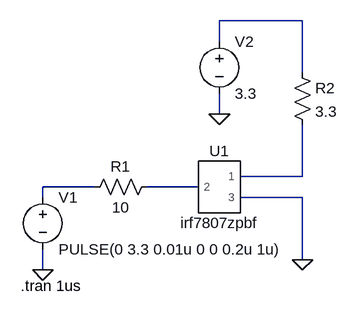
[diagram p0: schematic Frontend.asc]
Frontend.asc, the LTspice schematic file:
Version 4
SHEET 1 880 680
WIRE 304 -112 176 -112
WIRE 176 -80 176 -112
WIRE 304 -32 304 -112
WIRE 176 32 176 0
WIRE 304 128 304 48
WIRE 304 128 208 128
WIRE -16 144 -96 144
WIRE 144 144 64 144
WIRE -96 160 -96 144
WIRE 304 160 208 160
WIRE 304 256 304 160
WIRE -96 272 -96 240
FLAG 304 256 0
FLAG -96 272 0
FLAG 176 32 0
SYMBOL voltage -96 144 R0
WINDOW 123 0 0 Left 0
WINDOW 39 0 0 Left 0
SYMATTR InstName V1
SYMATTR Value PULSE(0 3.3 0.01u 0 0 0.2u 1u)
SYMBOL voltage 176 -96 R0
SYMATTR InstName V2
SYMATTR Value 3.3
SYMBOL res 80 128 R90
WINDOW 0 0 56 VBottom 2
WINDOW 3 32 56 VTop 2
SYMATTR InstName R1
SYMATTR Value 10
SYMBOL AutoGenerated\\irf7807zpbf 176 144 R0
SYMATTR InstName U1
SYMBOL res 288 -48 R0
SYMATTR InstName R2
SYMATTR Value 3.3
TEXT -130 296 Left 2 !.tran 1us

The netlist it stands for:
* Frontend.asc
V1 N003 0 PULSE(0 3.3 0.01u 0 0 0.2u 1u)
V2 N001 0 3.3
R1 N004 N003 10
XU1 N002 N004 0 irf7807zpbf  ; pins 1 2 3
R2 N001 N002 3.3
.tran 1us
.lib F:\6 -  Gitreppos\Glitchifier9000\Simulations\irf7807zpbf.cir
.backanno
.end